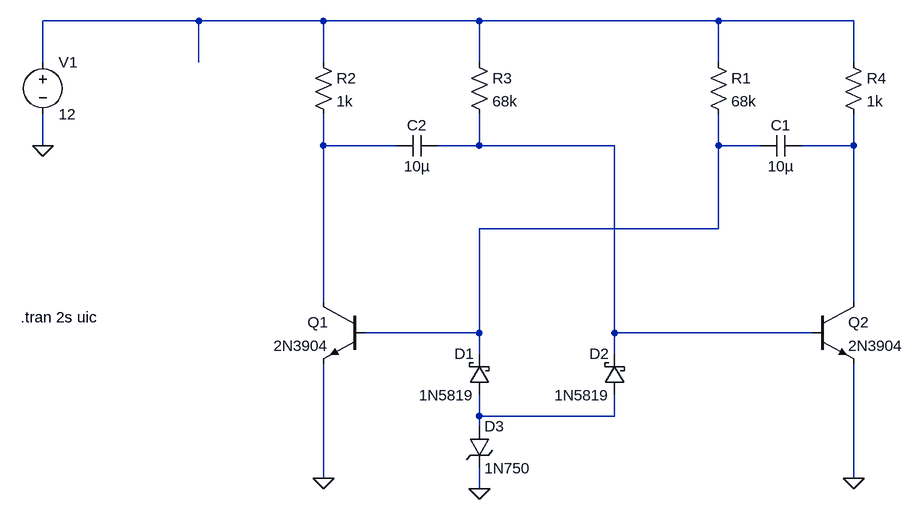
[diagram p0: schematic discrete.asc]
discrete.asc, the LTspice schematic file:
Version 4
SHEET 1 1128 740
WIRE 32 0 -208 0
WIRE 224 0 32 0
WIRE 464 0 224 0
WIRE 832 0 464 0
WIRE 1040 0 832 0
WIRE -208 64 -208 0
WIRE 32 64 32 0
WIRE 224 64 224 0
WIRE 464 64 464 0
WIRE 832 64 832 0
WIRE 1040 64 1040 0
WIRE -208 192 -208 144
WIRE 224 192 224 144
WIRE 336 192 224 192
WIRE 464 192 464 144
WIRE 464 192 400 192
WIRE 672 192 464 192
WIRE 832 192 832 144
WIRE 896 192 832 192
WIRE 1040 192 1040 144
WIRE 1040 192 960 192
WIRE 832 320 832 192
WIRE 832 320 464 320
WIRE 224 432 224 192
WIRE 1040 432 1040 192
WIRE 464 480 464 320
WIRE 464 480 288 480
WIRE 672 480 672 192
WIRE 976 480 672 480
WIRE 464 512 464 480
WIRE 672 512 672 480
WIRE 464 608 464 576
WIRE 672 608 672 576
WIRE 672 608 464 608
WIRE 464 624 464 608
WIRE 224 704 224 528
WIRE 1040 704 1040 528
WIRE 464 720 464 688
FLAG -208 192 0
FLAG 224 704 0
FLAG 1040 704 0
FLAG 464 720 0
SYMBOL res 816 48 R0
SYMATTR InstName R1
SYMATTR Value 68k
SYMBOL res 208 48 R0
SYMATTR InstName R2
SYMATTR Value 1k
SYMBOL res 448 48 R0
SYMATTR InstName R3
SYMATTR Value 68k
SYMBOL res 1024 48 R0
SYMATTR InstName R4
SYMATTR Value 1k
SYMBOL voltage -208 48 R0
WINDOW 123 0 0 Left 0
WINDOW 39 0 0 Left 0
SYMATTR InstName V1
SYMATTR Value 12
SYMBOL npn 288 432 M0
SYMATTR InstName Q1
SYMATTR Value 2N3904
SYMBOL npn 976 432 R0
SYMATTR InstName Q2
SYMATTR Value 2N3904
SYMBOL cap 400 176 R90
WINDOW 0 0 32 VBottom 2
WINDOW 3 32 32 VTop 2
SYMATTR InstName C2
SYMATTR Value 10µ
SYMBOL cap 960 176 R90
WINDOW 0 0 32 VBottom 2
WINDOW 3 32 32 VTop 2
SYMATTR InstName C1
SYMATTR Value 10µ
SYMBOL schottky 480 576 R180
WINDOW 0 24 64 Left 2
WINDOW 3 24 0 Left 2
SYMATTR InstName D1
SYMATTR Value 1N5819
SYMATTR Description Diode
SYMATTR Type diode
SYMBOL schottky 688 576 R180
WINDOW 0 24 64 Left 2
WINDOW 3 24 0 Left 2
SYMATTR InstName D2
SYMATTR Value 1N5819
SYMATTR Description Diode
SYMATTR Type diode
SYMBOL zener 448 624 R0
SYMATTR InstName D3
SYMATTR Value 1N750
SYMATTR Description Diode
SYMATTR Type diode
TEXT -242 456 Left 2 !.tran 2s uic

The netlist it stands for:
* discrete.asc
R1 N001 N004 68k
R2 N001 N002 1k
R3 N001 N003 68k
R4 N001 N005 1k
V1 N001 0 12
Q1 N002 N004 0 0 2N3904
Q2 N005 N003 0 0 2N3904
C2 N003 N002 10µ
C1 N005 N004 10µ
D1 N006 N004 1N5819
D2 N006 N003 1N5819
D3 N006 0 1N750
.model D D
.lib standard.dio
.model NPN NPN
.model PNP PNP
.lib standard.bjt
.tran 2s uic
.backanno
.end